# Altium schematic sheet Power.SchDoc: Power
size A; Author: Craig Hesling; DrawnBy: Craig Hesling; Revision: 3
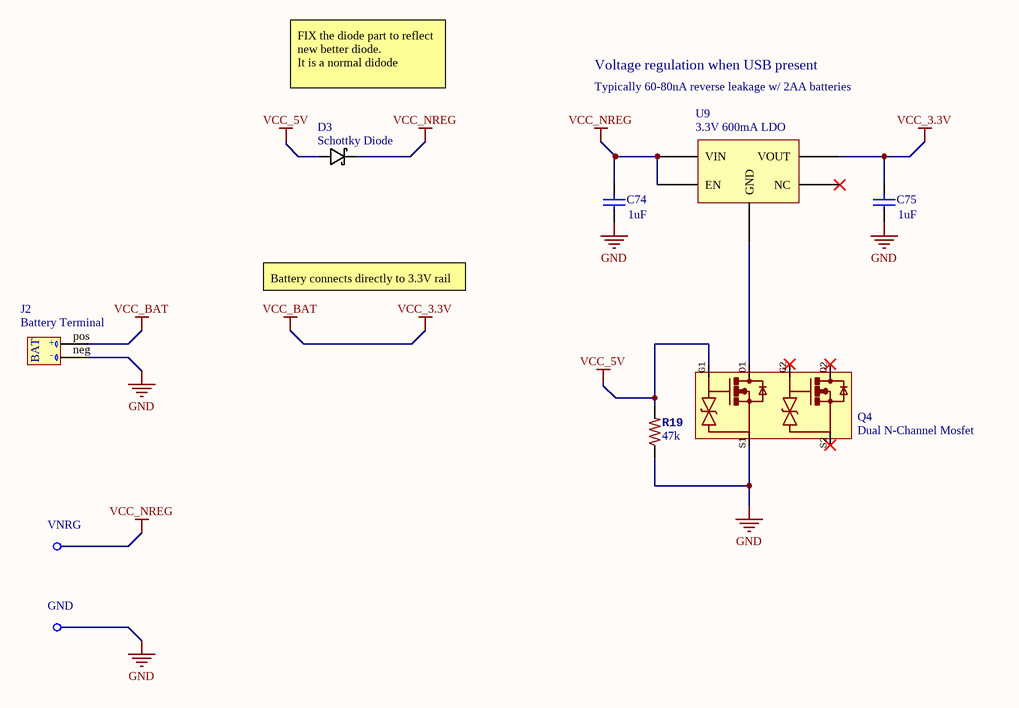
[diagram p0: Power.SchDoc]

## Parts
C74  value 1uF  [1608[0603]]  (hidden comment: Cap Semi)
C75  value 1uF  [1608[0603]]  (hidden comment: Cap Semi)
D3  Schottky Diode  [DB2J20900L (high-density)]
GND  Test Pin  [pin_1mm]  (value not drawn)
J2  Battery Terminal  [Battery Terminal]
Q4  Dual N-Channel Mosfet  [FC6946010R (high-density)]
R19  value 47k  [0603-RES]  (hidden comment: RES-00818)
U9  3.3V 600mA LDO  [AP7365-SOT25 (high-density)]
VNRG  (no value)  [pin_1mm]

## Nets
GND: C74.1 C75.1 GND.1(pin) J2.neg Q4.S1 R19.1
VCC_3.3V: C75.2 J2.pos U9.VOUT  [also labelled VCC_BAT]
VCC_5V: D3.2 Q4.G1 R19.2
VCC_NREG: C74.2 D3.1 U9.EN U9.VIN VNRG.1(pin)
NetQ4_D1: Q4.D1 U9.GND

Not connected (* = marked no-connect by the designer): Q4 D2* G2* S2*; U9 NC*

## Notes on the sheet
- FIX the diode part to reflect new better diode.
  It is a normal didode
- Voltage regulation when USB present
- Typically 60-80nA reverse leakage w/ 2AA batteries
- Battery connects directly to 3.3V rail
- (in symbol Battery Terminal) +; BAT; -

## Library data of the parts
C74 C75 = Cap Semi: Capacitor (Semiconductor SIM Model); Published: 8-Jun-2000; LatestRevisionDate: 29-May-2009; LatestRevisionNote: IPC-7351 Footprint Added.; PackageReference: C1206; Publisher: Altium Limited; PackageDescription: Chip Capacitor
D3 = DB2J20900L: Schottky Diode BAS 52-02V H6327
GND = test_pin: LatestRevisionDate: 05-oct-2007  -  Semtech
Q4 = FC6946010R: Panasonic Dual N-Channel Moseft FC6946010R; Supplier 1: Newark; Supplier 2: Digi-Key; Supplier Part Number 1: 63W2173; Supplier Part Number 2: FC6946010RCT-ND
R19 = 330OHM1/10W1%(0603): PROD_ID: RES-00818
U9 = AP7365-33WG-7: AP7365-33WG-7 3.9V 600mA LDO; Supplier 1: Digi-Key; Supplier 2: Arrow; Supplier Part Number 1: AP7365-33WG-7DICT-ND; Supplier Part Number 2: 8jDkOUuQMN4bQRMK7daIL_aN6lyR31ZrRHAvlbe4_1s
VNRG = test_pin: Voltage Non-Regulated; LatestRevisionDate: 05-oct-2007  -  Semtech